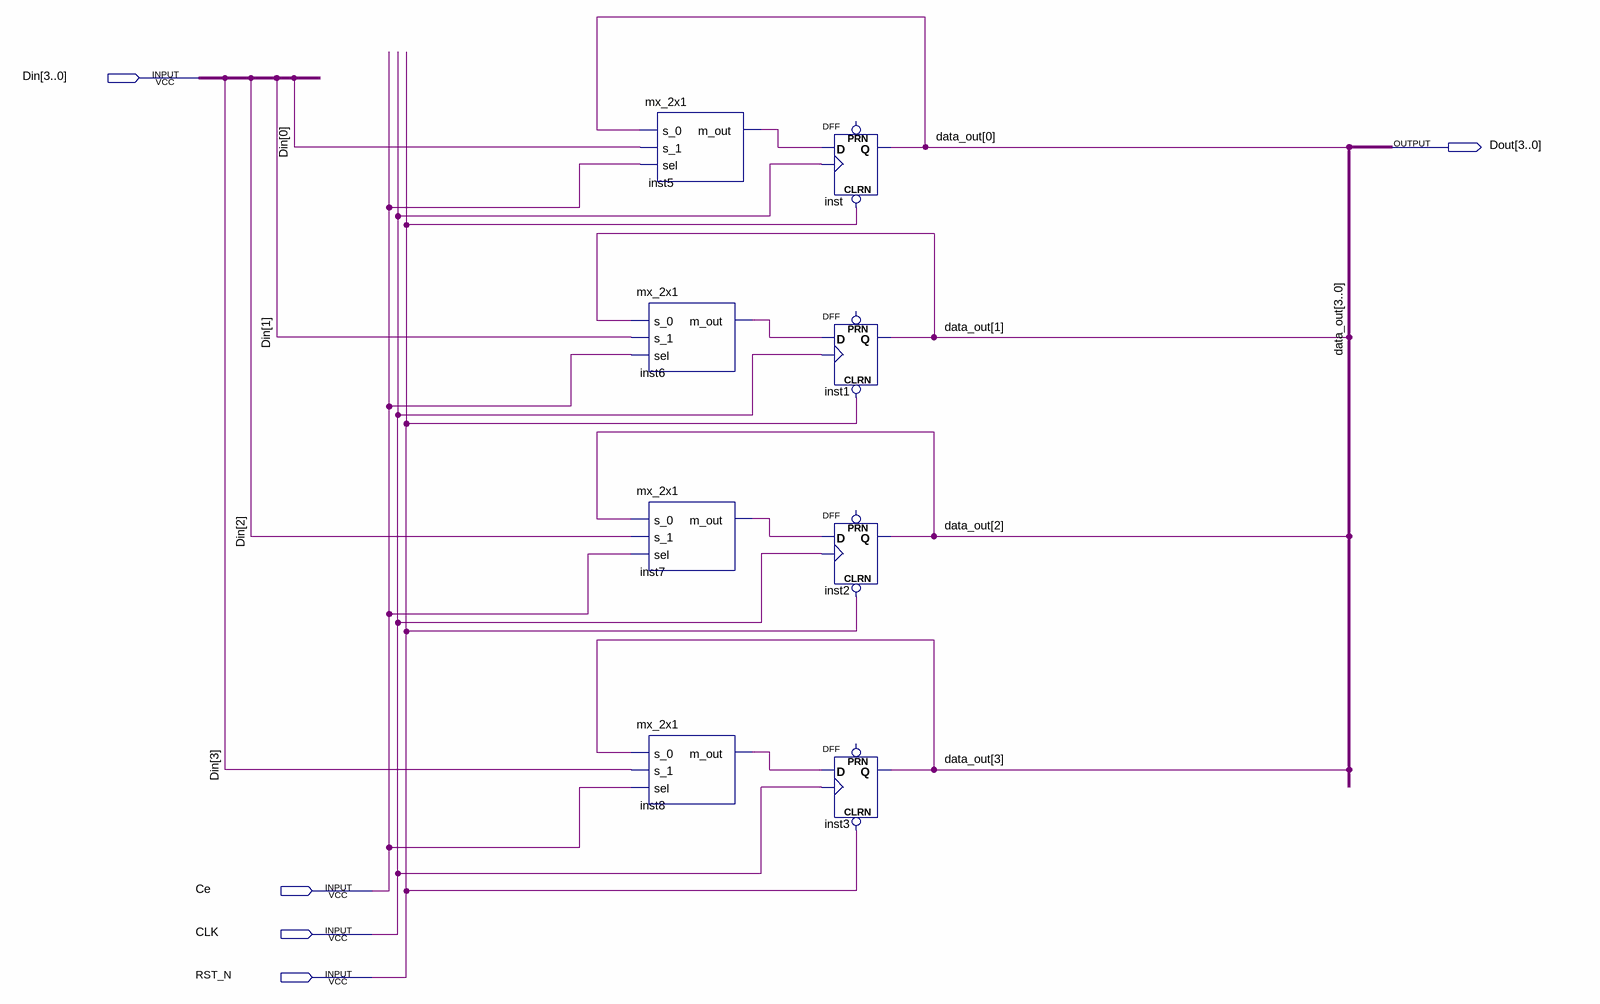
[diagram p0: schematic sheet]
// Quartus schematic four_bit_register.bdf as structural Verilog: 8 symbols, 5 pins
module four_bit_register (
  input  [3:0] Din,
  input  Ce,
  input  CLK,
  input  RST_N,
  output [3:0] Dout
);

  wire inst5_m_out, inst6_m_out, inst7_m_out, inst8_m_out;

  mx_2x1 inst5 (.s_0(Dout[0]), .s_1(Din[0]), .sel(Ce), .m_out(inst5_m_out));
  mx_2x1 inst6 (.s_0(Dout[1]), .s_1(Din[1]), .sel(Ce), .m_out(inst6_m_out));
  mx_2x1 inst7 (.s_0(Dout[2]), .s_1(Din[2]), .sel(Ce), .m_out(inst7_m_out));
  mx_2x1 inst8 (.s_0(Dout[3]), .s_1(Din[3]), .sel(Ce), .m_out(inst8_m_out));
  DFF inst (.CLRN(RST_N), .CLK(CLK), .D(inst5_m_out), .Q(Dout[0]));  // open: PRN
  DFF inst1 (.CLRN(RST_N), .CLK(CLK), .D(inst6_m_out), .Q(Dout[1]));  // open: PRN
  DFF inst2 (.CLRN(RST_N), .CLK(CLK), .D(inst7_m_out), .Q(Dout[2]));  // open: PRN
  DFF inst3 (.CLRN(RST_N), .CLK(CLK), .D(inst8_m_out), .Q(Dout[3]));  // open: PRN

  // Other names for the same wires on the sheet: data_out[3:0] = Dout
endmodule
